# Altium schematic sheet PowerSupply5V.SchDoc
size A3; SheetNumber: 2; SheetTotal: 3
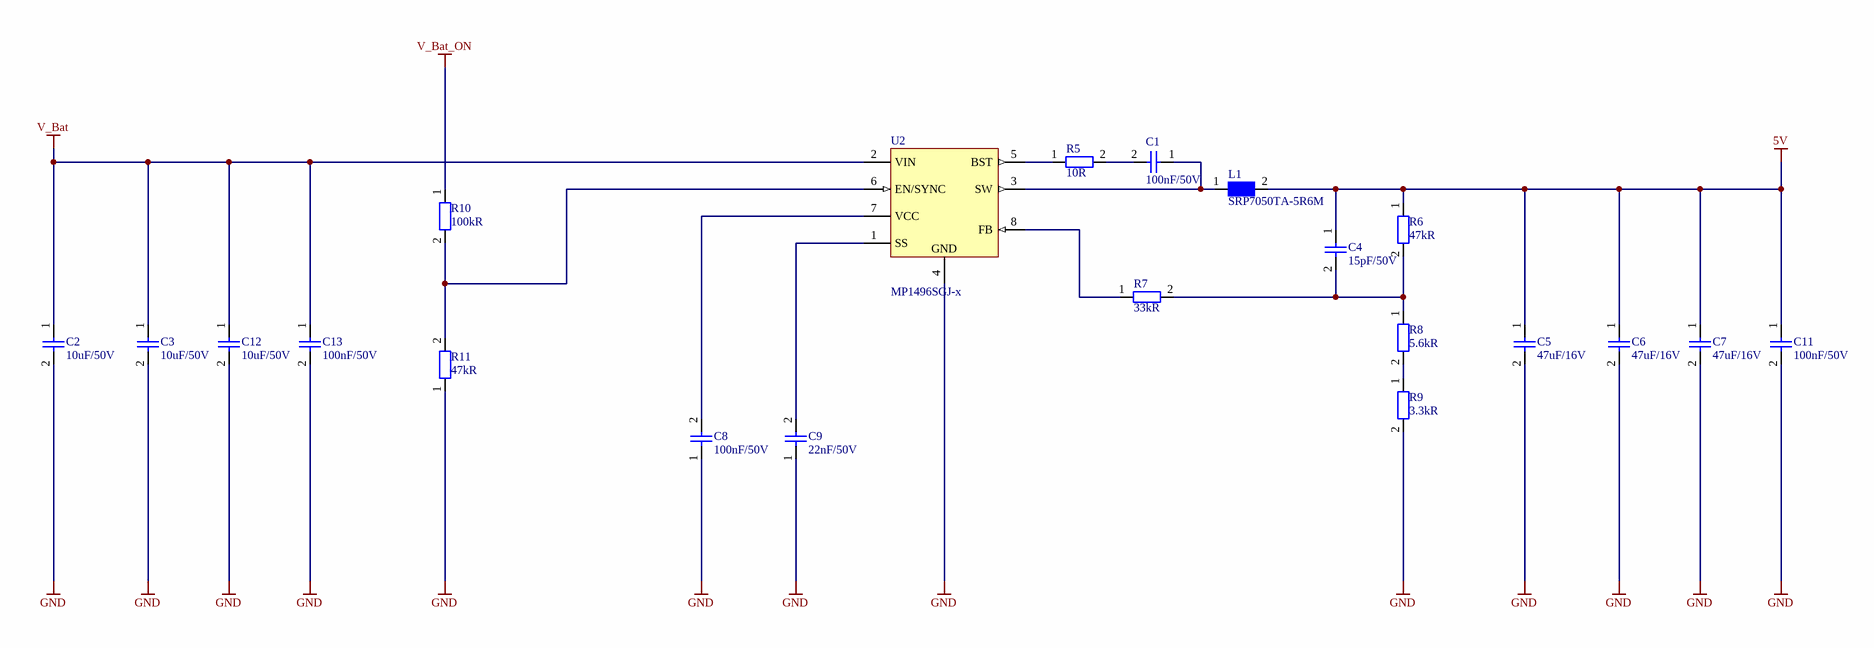
[diagram p0: PowerSupply5V.SchDoc]

## Parts
C1  100nF/50V  [CAPC1005X05L]
C2  10uF/50V  [CAPC3225X25L]
C3  10uF/50V  [CAPC3225X25L]
C4  15pF/50V  [CAPC1005X05L]
C5  47uF/16V  [CAPC3225X25L]
C6  47uF/16V  [CAPC3225X25L]
C7  47uF/16V  [CAPC3225X25L]
C8  100nF/50V  [CAPC1005X05L]
C9  22nF/50V  [CAPC1005X05L]
C11  100nF/50V  [CAPC1005X05L]
C12  10uF/50V  [CAPC3225X25L]
C13  100nF/50V  [CAPC1005X05L]
L1  SRP7050TA-5R6M  [INDP7366X50L]
R5  10R  [RESC1005X04L]
R6  47kR  [RESC1005X04L]
R7  33kR  [RESC1005X04L]
R8  5.6kR  [RESC1005X04L]
R9  3.3kR  [RESC1005X04L]
R10  100kR  [RESC1005X04L]
R11  47kR  [RESC1005X04L]
U2  MP1496SGJ-x  [TSOP65P280X100-8L]

## Nets
5V: C4.1 C5.1 C6.1 C7.1 C11.1 L1.2 R6.1
GND: C2.2 C3.2 C5.2 C6.2 C7.2 C8.1 C9.1 C11.2 C12.2 C13.2 R9.2 R11.1 U2.4(GND)
V_Bat: C2.1 C3.1 C12.1 C13.1 U2.2(VIN)
V_Bat_ON: R10.1
NetC1_1: C1.1 L1.1 U2.3(SW)
NetC1_2: C1.2 R5.2
NetC4_2: C4.2 R6.2 R7.2 R8.1
NetC8_2: C8.2 U2.7(VCC)
NetC9_2: C9.2 U2.1(SS)
NetR5_1: R5.1 U2.5(BST)
NetR7_1: R7.1 U2.8(FB)
NetR8_2: R8.2 R9.1
NetR10_2: R10.2 R11.2 U2.6(EN/SYNC)

## Notes on the sheet
- Schematic Name
- Document Number
- File:
- Sheet
- Size
- A3
- Project Name
- of
- Print date:
- Drawn by:
- Revision
- Repo:
- Variant:

## Library data of the parts
C1 C8 C11 C13 = CMP-001-00067-18: Cap MLCC, 100nF, 50V, X7R, 10%, 0402; Case/Package: 0402; Voltage Rating: 50V; Dielectricum: X7R; Mounting Technology: SMD; Type: MLCC; Tolerance: 10%; Case Code (Metric): 1005; Value: 100nF
C2 C3 C12 = CMP-00032-8: Cap MLCC, 10uF, 50V, X7R, 20%, 1210; Value: 10µF; Type: MLCC; Voltage Rating: 50V; Case/Package: 1210; Mounting Technology: SMD; Dielectricum: X7R; Tolerance: 20%; Case Code (Metric): 3525
C4 = CMP-00153-5: Cap MLCC, 15pF, 50V, C0G, 5%, 0402; Mounting Technology: SMD; Tolerance: 5%; Type: MLCC; Voltage Rating: 50V; Case Code (Metric): 1005; Case/Package: 0402; Value: 15pF; Dielectricum: C0G
C5-C7 = CMP-001-00097-16: Cap MLCC, 47uF, 16V, X5R, 20%, 1210; Value: 47µF; Dielectricum: X5R; Case Code (Metric): 3525; Voltage Rating: 16V; Case/Package: 1210; Tolerance: 20%; Mounting Technology: SMD; Type: MLCC
C9 = CMP-001-00062-18: Cap MLCC, 22nF, 50V, X7R, 10%, 0402; Dielectricum: X7R; Value: 22nF; Voltage Rating: 50V; Tolerance: 10%; Case/Package: 0402; Type: MLCC; Mounting Technology: SMD; Case Code (Metric): 1005
L1 = CMP-006-00040-7: Coil, 5.6uH, 49mR, 6A, 20%, 6A, 2626; Resistance DC: 49m; Inductivity: 5.6µH; Mounting Technology: SMD; Tolerance: 20%; Current: 6A; Case/Package: 2626
R5 = CMP-009-00152-29: Res, 10R, 1%, 0.063W, 0402; Voltage Rating: 50V; Value: 10; Power: 63mW; Mounting Technology: SMD; Case/Package: 0402; Tolerance: 1%; Type: Fixed; Case Code (Metric): 1005
R6 R11 = CMP-009-00137-31: Res, 47kR, 1%, 0.063W, 0402; Voltage Rating: 50V; Value: 47k; Power: 63mW; Type: Fixed; Mounting Technology: SMD; Tolerance: 1%; Case/Package: 0402; Case Code (Metric): 1005
R7 = CMP-009-00028-32: Res, 33kR, 1%, 0.063W, 0402; Power: 63mW; Voltage Rating: 50V; Value: 33k; Case/Package: 0402; Tolerance: 1%; Mounting Technology: SMD; Type: Fixed; Case Code (Metric): 1005
R8 = CMP-009-00136-30: Res, 5.6kR, 1%, 0.063W, 0402; Voltage Rating: 50V; Power: 63mW; Value: 5.6k; Type: Fixed; Tolerance: 1%; Case Code (Metric): 1005; Case/Package: 0402; Mounting Technology: SMD
R9 = CMP-009-00085-21: Res, 3.3kR, 1%, 0.063W, 0402; Power: 63mW; Value: 3.3k; Voltage Rating: 50V; Case/Package: 0402; Tolerance: 1%; Type: Fixed; Mounting Technology: SMD; Case Code (Metric): 1005
R10 = CMP-009-00022-33: Res, 100kR, 1%, 0.1W, 0402; Voltage Rating: 50V; Value: 100k; Power: 100mW; Type: Fixed; Case Code (Metric): 1005; Mounting Technology: SMD; Case/Package: 0402; Tolerance: 1%
U2 = CMP-00363-5: Buck Converter, 0.8..15.2V, 2A, 4.5..16Vin, TSOP-8; Max In Voltage: 16V; Min Out Voltage: 800mV; Max Out Voltage: 15.2V; Frequency: 500kHz; Min In Voltage: 4.5V; Max Out Current: 2A; Case/Package: TSOP-8; Mounting Technology: SMD